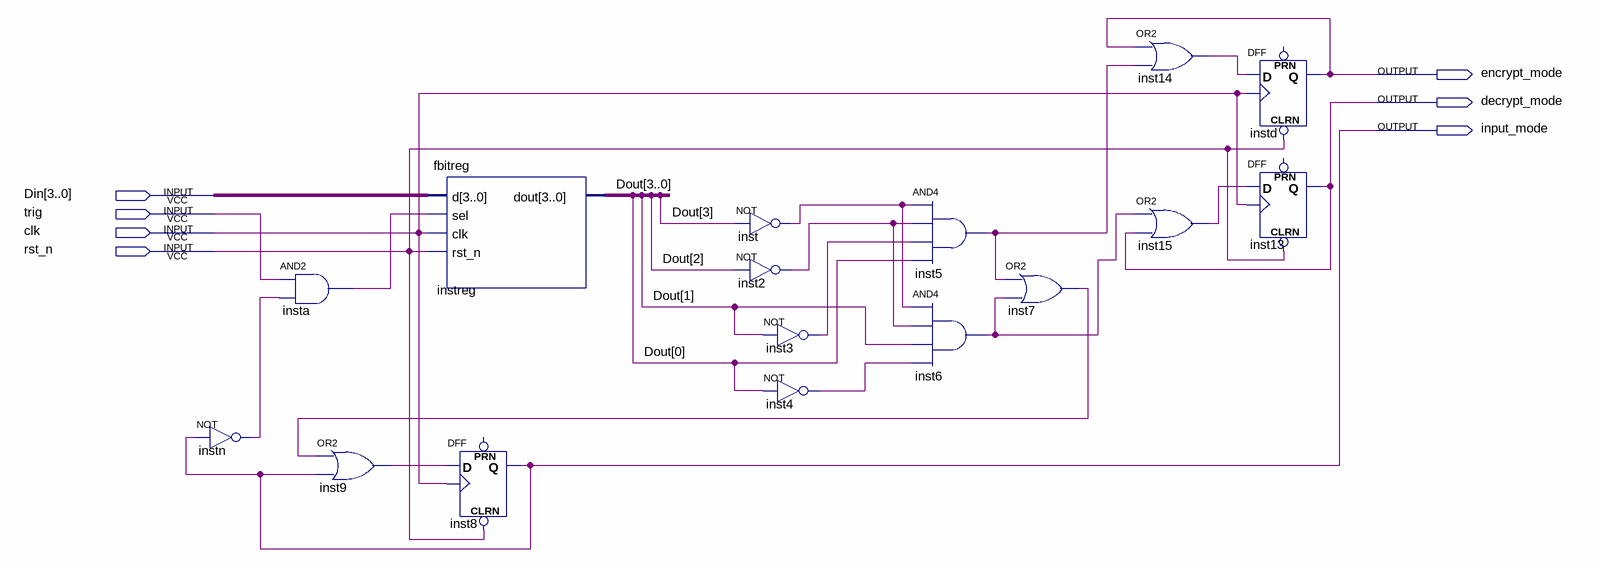
[diagram p0: schematic sheet]
// Quartus schematic mode_selector.bdf as structural Verilog: 16 symbols, 7 pins
module mode_selector (
  input  [3:0] Din,
  input  trig,
  input  clk,
  input  rst_n,
  output encrypt_mode,
  output decrypt_mode,
  output input_mode
);

  wire inst2_out, inst3_out, inst4_out, inst5_out, inst6_out, inst7_out, inst9_out, inst14_out, inst15_out,
       inst_out, insta_out, instn_out;
  wire [3:0] Dout;

  not instn (instn_out, input_mode);
  and insta (insta_out, trig, instn_out);
  or inst9 (inst9_out, inst7_out, input_mode);
  fbitreg instreg (.d(Din), .sel(insta_out), .clk(clk), .rst_n(rst_n), .dout(Dout));
  DFF inst8 (.CLRN(rst_n), .CLK(clk), .D(inst9_out), .Q(input_mode));  // open: PRN
  not inst (inst_out, Dout[3]);
  not inst2 (inst2_out, Dout[2]);
  not inst3 (inst3_out, Dout[1]);
  not inst4 (inst4_out, Dout[0]);
  and inst5 (inst5_out, inst_out, inst2_out, inst3_out, Dout[0]);
  and inst6 (inst6_out, inst_out, inst2_out, Dout[1], inst4_out);
  or inst7 (inst7_out, inst5_out, inst6_out);
  or inst14 (inst14_out, encrypt_mode, inst5_out);
  or inst15 (inst15_out, inst6_out, decrypt_mode);
  DFF instd (.CLRN(rst_n), .CLK(clk), .D(inst14_out), .Q(encrypt_mode));  // open: PRN
  DFF inst13 (.CLRN(rst_n), .CLK(clk), .D(inst15_out), .Q(decrypt_mode));  // open: PRN
endmodule
